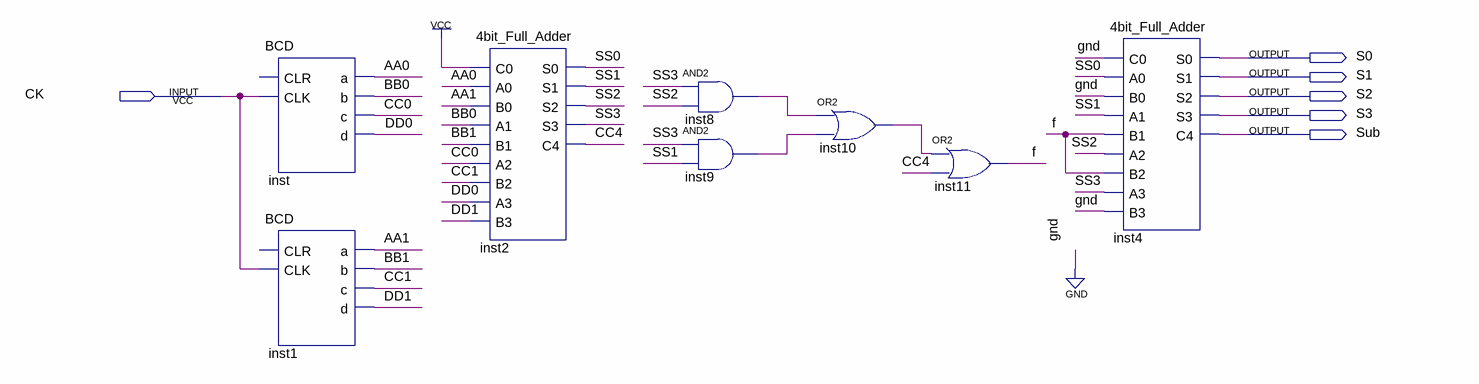
[diagram p0: schematic sheet]
// Quartus schematic FPGA_4bit_BCD_Adder.bdf as structural Verilog: 8 symbols, 6 pins
module FPGA_4bit_BCD_Adder (
  input  CK,
  output S0,
  output S1,
  output S2,
  output S3,
  output Sub
);

  wire AA0, AA1, BB0, BB1, CC0, CC1, CC4, DD0, DD1, f, inst8_out, inst9_out, inst10_out, SS0, SS1, SS2, SS3;

  BCD inst (.CLK(CK), .a(AA0), .b(BB0), .c(CC0), .d(DD0));  // open: CLR
  BCD inst1 (.CLK(CK), .a(AA1), .b(BB1), .c(CC1), .d(DD1));  // open: CLR
  \4bit_Full_Adder  inst2 (
    .C0(1'b1), .A0(AA0), .B0(AA1), .A1(BB0), .B1(BB1), .A2(CC0), .B2(CC1), .A3(DD0), .B3(DD1), .S0(SS0),
    .S1(SS1), .S2(SS2), .S3(SS3), .C4(CC4));
  and inst8 (inst8_out, SS3, SS2);
  and inst9 (inst9_out, SS3, SS1);
  or inst10 (inst10_out, inst8_out, inst9_out);
  or inst11 (f, inst10_out, CC4);
  \4bit_Full_Adder  inst4 (
    .C0(1'b0), .A0(SS0), .B0(1'b0), .A1(SS1), .B1(f), .A2(SS2), .B2(f), .A3(SS3), .B3(1'b0), .S0(S0),
    .S1(S1), .S2(S2), .S3(S3), .C4(Sub));
endmodule
